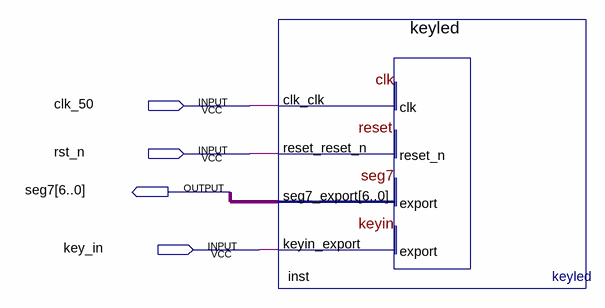
[diagram p0: schematic sheet]
// Quartus schematic keyled_sopc.bdf as structural Verilog: 1 symbols, 4 pins
module keyled_sopc (
  input  clk_50,
  input  rst_n,
  input  key_in,
  output [6:0] seg7
);

  keyled inst (.clk_clk(clk_50), .reset_reset_n(rst_n), .keyin_export(key_in), .seg7_export(seg7));
endmodule
